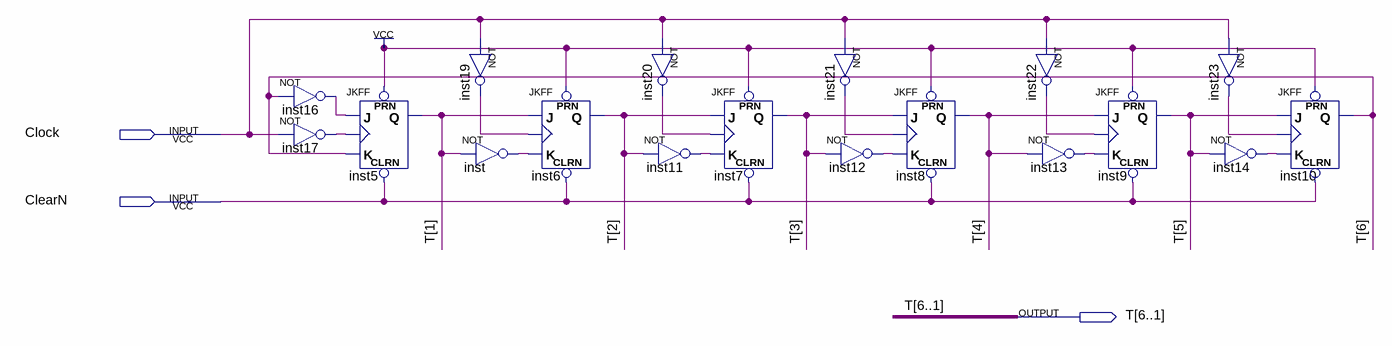
[diagram p0: schematic sheet]
// Quartus schematic Ring_Counter.bdf as structural Verilog: 18 symbols, 3 pins
module Ring_Counter (
  input  Clock,
  input  ClearN,
  output [6:1] T
);

  wire inst11_out, inst12_out, inst13_out, inst14_out, inst16_out, inst17_out, inst19_out, inst20_out,
       inst21_out, inst22_out, inst23_out, inst_out;

  not inst16 (inst16_out, T[6]);
  not inst17 (inst17_out, Clock);
  JKFF inst5 (.PRN(1'b1), .CLRN(ClearN), .K(T[6]), .J(inst16_out), .CLK(inst17_out), .Q(T[1]));
  not inst19 (inst19_out, Clock);
  not inst (inst_out, T[1]);
  JKFF inst6 (.PRN(1'b1), .CLRN(ClearN), .K(inst_out), .J(T[1]), .CLK(inst19_out), .Q(T[2]));
  not inst20 (inst20_out, Clock);
  not inst11 (inst11_out, T[2]);
  JKFF inst7 (.PRN(1'b1), .CLRN(ClearN), .K(inst11_out), .J(T[2]), .CLK(inst20_out), .Q(T[3]));
  not inst21 (inst21_out, Clock);
  JKFF inst8 (.PRN(1'b1), .CLRN(ClearN), .K(inst12_out), .J(T[3]), .CLK(inst21_out), .Q(T[4]));
  not inst12 (inst12_out, T[3]);
  not inst22 (inst22_out, Clock);
  not inst13 (inst13_out, T[4]);
  JKFF inst9 (.PRN(1'b1), .CLRN(ClearN), .K(inst13_out), .J(T[4]), .CLK(inst22_out), .Q(T[5]));
  not inst23 (inst23_out, Clock);
  JKFF inst10 (.PRN(1'b1), .CLRN(ClearN), .K(inst14_out), .J(T[5]), .CLK(inst23_out), .Q(T[6]));
  not inst14 (inst14_out, T[5]);
endmodule
